# Altium schematic sheet Estágio 1 - Diferencial.SchDoc
size A
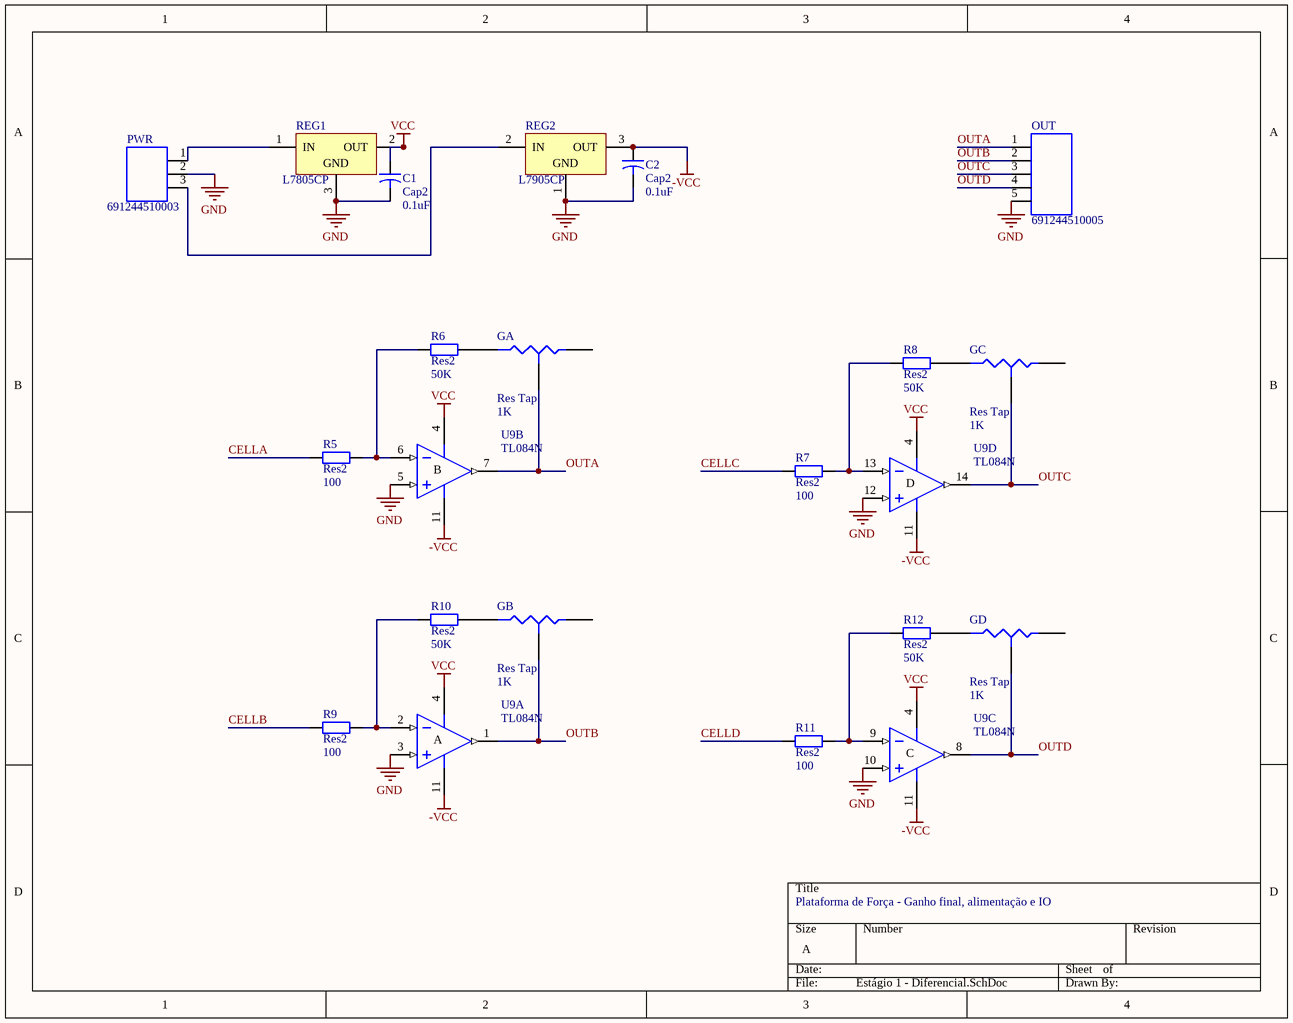
[diagram p0: Estágio 1 - Diferencial.SchDoc]

## Parts
C1  Cap2  value 0.1uF  [CAPR5-4X5]
C2  Cap2  value 0.1uF  [CAPR5-4X5]
GA  Res Tap  value 1K  [3296W]
GB  Res Tap  value 1K  [3296W]
GC  Res Tap  value 1K  [3296W]
GD  Res Tap  value 1K  [3296W]
OUT  691244510005  [691244510005]
PWR  691244510003  [691244510003]
R5  Res2  value 100  [AXIAL-0.4]
R6  Res2  value 50K  [AXIAL-0.4]
R7  Res2  value 100  [AXIAL-0.4]
R8  Res2  value 50K  [AXIAL-0.4]
R9  Res2  value 100  [AXIAL-0.4]
R10  Res2  value 50K  [AXIAL-0.4]
R11  Res2  value 100  [AXIAL-0.4]
R12  Res2  value 50K  [AXIAL-0.4]
REG1  L7805CP  [ISOWATT220AB]
REG2  L7905CP  [ISOWATT220AB]
U9  TL084N  [N014]  (parts A,B,C,D of 4)

## Nets
-VCC: C2.1 REG2.3(OUT) U9.11(V-)
GND: C1.2 C2.2 OUT.5 PWR.2 REG1.3(GND) REG2.1(GND) U9.3(IN+) U9.5(IN+) U9.10(IN+) U9.12(IN+)
VCC: C1.1 REG1.2(OUT) U9.4(V+)
CELLA: R5.1
CELLB: R9.1
CELLC: R7.1
CELLD: R11.1
OUTA: GA.3(TAP) OUT.1 U9.7(OUT)
OUTB: GB.3(TAP) OUT.2 U9.1(OUT)
OUTC: GC.3(TAP) OUT.3 U9.14(OUT)
OUTD: GD.3(TAP) OUT.4 U9.8(OUT)
NetGA_2: GA.2(B) R6.2
NetGB_2: GB.2(B) R10.2
NetGC_2: GC.2(B) R8.2
NetGD_2: GD.2(B) R12.2
NetPWR_1: PWR.1 REG1.1(IN)
NetPWR_3: PWR.3 REG2.2(IN)
NetR5_2: R5.2 R6.1 U9.6(IN-)
NetR7_2: R7.2 R8.1 U9.13(IN-)
NetR9_2: R9.2 R10.1 U9.2(IN-)
NetR11_2: R11.2 R12.1 U9.9(IN-)

Not connected (* = marked no-connect by the designer): GA 1(A); GB 1(A); GC 1(A); GD 1(A)

## Notes on the sheet
- Plataforma de Força - Ganho final, alimentação e IO
- (in symbol TL084N, part A) A
- (in symbol TL084N, part B) B
- (in symbol TL084N, part C) C
- (in symbol TL084N, part D) D

## Library data of the parts
C1 C2 = Cap2: Capacitor; Published: 23-Sep-2002; PackageReference: CAPR5-4X5; Publisher: Altium Limited; PackageDescription: Capacitor; 2 Leads
GA GB GC GD = Res Tap: Tapped Resistor; Sim Note: Enter the Resistance value and the set point into parameter fields.; Set Position: 0.5; Published: 24-Mar-1999; LatestRevisionDate: 17-Jul-2002; LatestRevisionNote: Re-released for DXP Platform.; PackageReference: VR3; Publisher: Altium Limited; PackageDescription: Variable Resistor, Thru-Hole; 3 Leads
OUT = 691244510005: WR-TBL Horizontal Cable Entry With Rising Cage Clamp,Serie 2445 - 5.08 mm; Manufacturer: Wurth Elektronik; ComponentLink1 Description: Manufacturer; ComponentLink2 Description: Datasheet; ComponentLink1URL: http://www.we-online.de; ComponentLink2URL: http://katalog.we-online.de/em/datasheet/6912445100XX.pdf; Created by: Baojun Chen; Created Date: 15.Sep.2015; partNo: 691244510005
PWR = 691244510003: WR-TBL Horizontal Cable Entry With Rising Cage Clamp,Serie 2445 - 5.08 mm; Manufacturer: Wurth Elektronik; ComponentLink1 Description: Manufacturer; ComponentLink2 Description: Datasheet; ComponentLink1URL: http://www.we-online.de; ComponentLink2URL: http://katalog.we-online.de/em/datasheet/6912445100XX.pdf; Created by: Baojun Chen; Created Date: 15.Sep.2015; partNo: 691244510003
R5-R12 = Res2: Resistor; Published: 8-Jun-2000; LatestRevisionDate: 17-Jul-2002; LatestRevisionNote: Re-released for DXP Platform.; PackageReference: AXIAL-0.4; Publisher: Altium Limited; PackageDescription: Axial Device, Thru-Hole; 2 Leads; 0.4 in Pin Spacing
REG1 = L7805CP: Positive Voltage Regulator; Note: Tab is connected to pin 3 (GND).; Published: 24-Aug-2001; LatestRevisionDate: 17-Jul-2002; LatestRevisionNote: Re-released for DXP Platform.; DatasheetVersion: Dec-1998; PackageVersion: Jul-1998; PackageReference: ISOWATT220AB; Publisher: Altium Limited; PackageDescription: TO, Thru-Hole, Vertical, Heatsink Mounted; 3 In-Line Leads; Pitch 2.54 mm; Pin sequence 1, 3, 2; ComponentLink1Description: Manufacturer Link; ComponentLink1URL: http://www.st.com/
REG2 = L7905CP: Negative Voltage Regulator; Note: Tab is connected to pin 3 (IN).; Published: 24-Aug-2001; LatestRevisionDate: 17-Jul-2002; LatestRevisionNote: Re-released for DXP Platform.; DatasheetVersion: Apr-1997; PackageVersion: Jul-1998; PackageReference: ISOWATT220AB; Publisher: Altium Limited; PackageDescription: TO, Thru-Hole, Vertical, Heatsink Mounted; 3 In-Line Leads; Pitch 2.54 mm; Pin sequence 1, 3, 2; ComponentLink1Description: Manufacturer Link; ComponentLink1URL: http://www.st.com/; ComponentLink2Description: Datasheet; ComponentLink2URL: http://www.st.com/stonline/products/literature/ds/2149/l7905c.pdf
U9 = TL084N: JFET-Input Operational Amplifier; Published: 16-Jan-2001; LatestRevisionDate: 04-Mar-2005; LatestRevisionNote: Stylized 3D Model Added.; DatasheetVersion: Feb-1999; PackageVersion: Oct-1995; PackageReference: N014; Publisher: Altium Limited; PackageDescription: DIP; 14 Leads; Row Spacing 7.62 mm; Pitch 2.54 mm; ComponentLink1Description: Manufacturer Link; ComponentLink1URL: http://www.ti.com/; ComponentLink2Description: Datasheet; ComponentLink2URL: http://www-s.ti.com/sc/ds/tl084.pdf